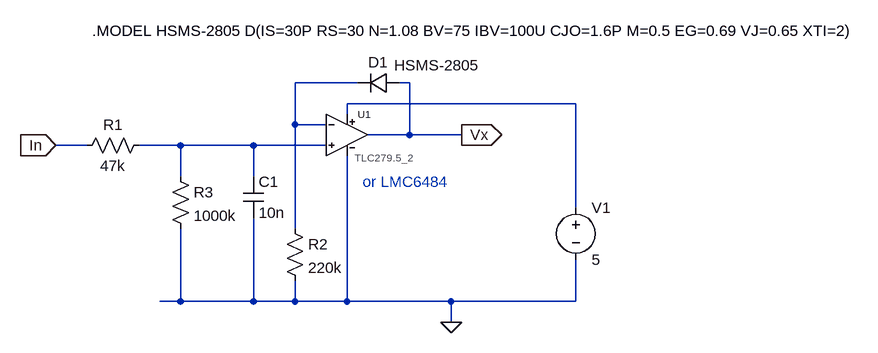
[diagram p0: schematic BridgeAmp.asc]
BridgeAmp.asc, the LTspice schematic file:
Version 4.1
SHEET 1 1092 680
WIRE 240 -48 144 -48
WIRE 320 -48 304 -48
WIRE 576 -16 224 -16
WIRE 224 0 224 -16
WIRE 144 16 144 -48
WIRE 192 16 144 16
WIRE 320 32 320 -48
WIRE 320 32 256 32
WIRE 400 32 320 32
WIRE -176 48 -224 48
WIRE -32 48 -96 48
WIRE 80 48 -32 48
WIRE 192 48 80 48
WIRE -32 96 -32 48
WIRE 80 96 80 48
WIRE 576 144 576 -16
WIRE 144 176 144 16
WIRE -32 288 -32 176
WIRE -32 288 -64 288
WIRE 80 288 80 160
WIRE 80 288 -32 288
WIRE 144 288 144 256
WIRE 144 288 80 288
WIRE 224 288 224 64
WIRE 224 288 144 288
WIRE 384 288 224 288
WIRE 576 288 576 224
WIRE 576 288 384 288
WIRE 384 320 384 288
FLAG 400 32 Vx
IOPIN 400 32 Out
FLAG -224 48 In
IOPIN -224 48 In
FLAG 384 320 0
SYMBOL res -80 32 R90
WINDOW 0 0 56 VBottom 2
WINDOW 3 32 56 VTop 2
SYMATTR InstName R1
SYMATTR Value 47k
SYMBOL res 128 160 R0
SYMATTR InstName R2
SYMATTR Value 220k
SYMBOL diode 304 -64 R90
WINDOW 0 0 32 VBottom 2
WINDOW 3 -27 -58 VTop 2
SYMATTR InstName D1
SYMATTR Value HSMS-2805
SYMBOL res -48 80 R0
SYMATTR InstName R3
SYMATTR Value 1000k
SYMBOL cap 64 96 R0
SYMATTR InstName C1
SYMATTR Value 10n
SYMBOL TLC279.5_2 224 32 R0
SYMATTR InstName U1
SYMBOL voltage 576 128 R0
WINDOW 123 0 0 Left 0
WINDOW 39 0 0 Left 0
SYMATTR InstName V1
SYMATTR Value 5
TEXT 248 104 Left 2 ;or LMC6484
TEXT -168 -128 Left 2 !.MODEL HSMS-2805 D(IS=30P RS=30 N=1.08 BV=75 IBV=100U CJO=1.6P M=0.5 EG=0.69 VJ=0.65 XTI=2)

The netlist it stands for:
* BridgeAmp.asc
R1 N003 In 47k
R2 N001 0 220k
D1 Vx N001 HSMS-2805
R3 N003 0 1000k
C1 N003 0 10n
X§U1 N003 N001 N002 0 Vx level1 Avol=1Meg GBW=10Meg Vos=0 En=0 Enk=0 In=0 Ink=0 Rin=500Meg  ; pins In+ In- V+ V- OUT
V1 N002 0 5
.model D D
.lib standard.dio
* or LMC6484
.MODEL HSMS-2805 D(IS=30P RS=30 N=1.08 BV=75 IBV=100U CJO=1.6P M=0.5 EG=0.69 VJ=0.65 XTI=2)
.lib UniversalOpAmp1.lib
.backanno
.end